# EAGLE design untitled (EAGLE 6.6.0)
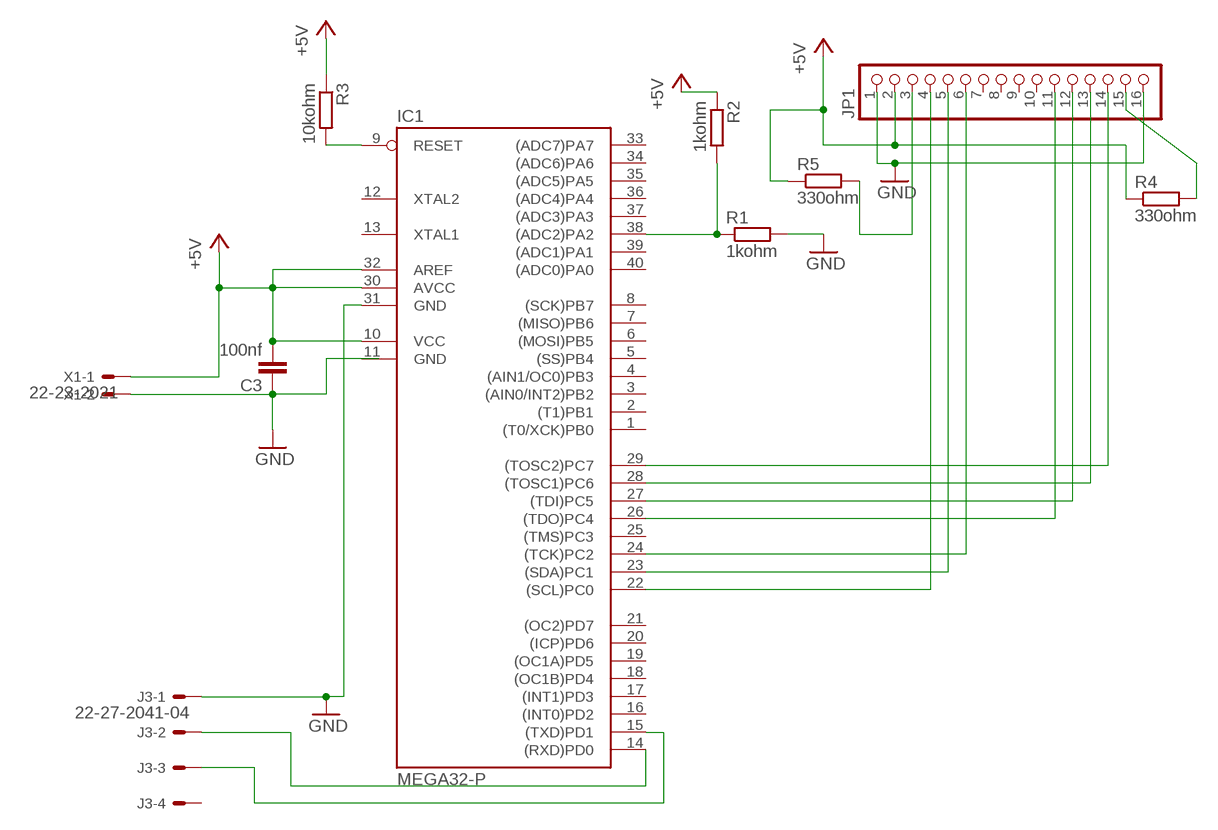
[diagram p0: schematic, sheet 1]

## Parts
C3  100nf  C-EU050-025X075  [C050-025X075]
IC1  MEGA32-P  [DIL40]
J3  22-27-2041-04  [6410-04]
JP1  PINHD-1X16  [1X16]
R1  1kohm  R-EU_0207/10  [0207/10]
R2  1kohm  R-EU_0207/10  [0207/10]
R3  10kohm  R-EU_0207/10  [0207/10]
R4  330ohm  R-EU_0207/10  [0207/10]
R5  330ohm  R-EU_0207/10  [0207/10]
X1  22-23-2021  [22-23-2021]

## Nets
+5V: C3.2 IC1.10(VCC) IC1.30(AVCC) IC1.32(AREF) JP1.2 R2.1 R3.1 R4.1 R5.1 X1.1
GND: C3.1 IC1.31(GND) J3.1 JP1.1 JP1.16 R1.2 X1.2
N$1: IC1.38((ADC2)PA2) R1.1 R2.2
N$2: IC1.22((SCL)PC0) JP1.4
N$3: IC1.23((SDA)PC1) JP1.5
N$5: IC1.29((TOSC2)PC7) JP1.14
N$6: IC1.28((TOSC1)PC6) JP1.13
N$7: IC1.27((TDI)PC5) JP1.12
N$8: IC1.26((TDO)PC4) JP1.11
N$9: IC1.9(RESET) R3.2
N$10: JP1.3 R5.2
N$12: IC1.24((TCK)PC2) JP1.6
N$14: IC1.14((RXD)PD0) J3.2
N$15: IC1.15((TXD)PD1) J3.3
N$17: JP1.15 R4.2
Unconnected: IC1.1((T0/XCK)PB0) IC1.2((T1)PB1) IC1.3((AIN0/INT2)PB2) IC1.4((AIN1/OC0)PB3) IC1.5((SS)PB4) IC1.6((MOSI)PB5) IC1.7((MISO)PB6) IC1.8((SCK)PB7) IC1.12(XTAL2) IC1.13(XTAL1) IC1.16((INT0)PD2) IC1.17((INT1)PD3) IC1.18((OC1B)PD4) IC1.19((OC1A)PD5) IC1.20((ICP)PD6) IC1.21((OC2)PD7) IC1.25((TMS)PC3) IC1.33((ADC7)PA7) IC1.34((ADC6)PA6) IC1.35((ADC5)PA5) IC1.36((ADC4)PA4) IC1.37((ADC3)PA3) IC1.39((ADC1)PA1) IC1.40((ADC0)PA0) J3.4 JP1.7 JP1.8 JP1.9 JP1.10

## Power pins joined to a net without a drawn wire
GND: IC1.11(GND)

## Library data of the parts
C3 = rcl:C-EU: CAPACITOR, European symbol
IC1 = atmel:MEGA32-P: MICROCONTROLLER 32 Kbytes FLASH 2 Kbytes SRAM 1 Kbytes EEPROM USART 8-channel 10 bit ADC Source: www.atmel.com .. doc2503.pdf; MPN: ATMEGA32-16PU; OC_FARNELL: 1661729; OC_NEWARK: 51P1794
J3 = con-molex:22-?-04: CONNECTOR wire to board 2.54 mm (.1 inch) pitch header; OC_FARNELL: unknown; OC_NEWARK: unknown
JP1 = pinhead:PINHD-1X16: PIN HEADER
R1-R5 = rcl:R-EU_: RESISTOR, European symbol
X1 = con-molex:22-23-2021: .100" (2.54mm) Center Header - 2 Pin; MF: MOLEX; MPN: 22-23-2021; OC_FARNELL: 1462926; OC_NEWARK: 25C3832

## Board
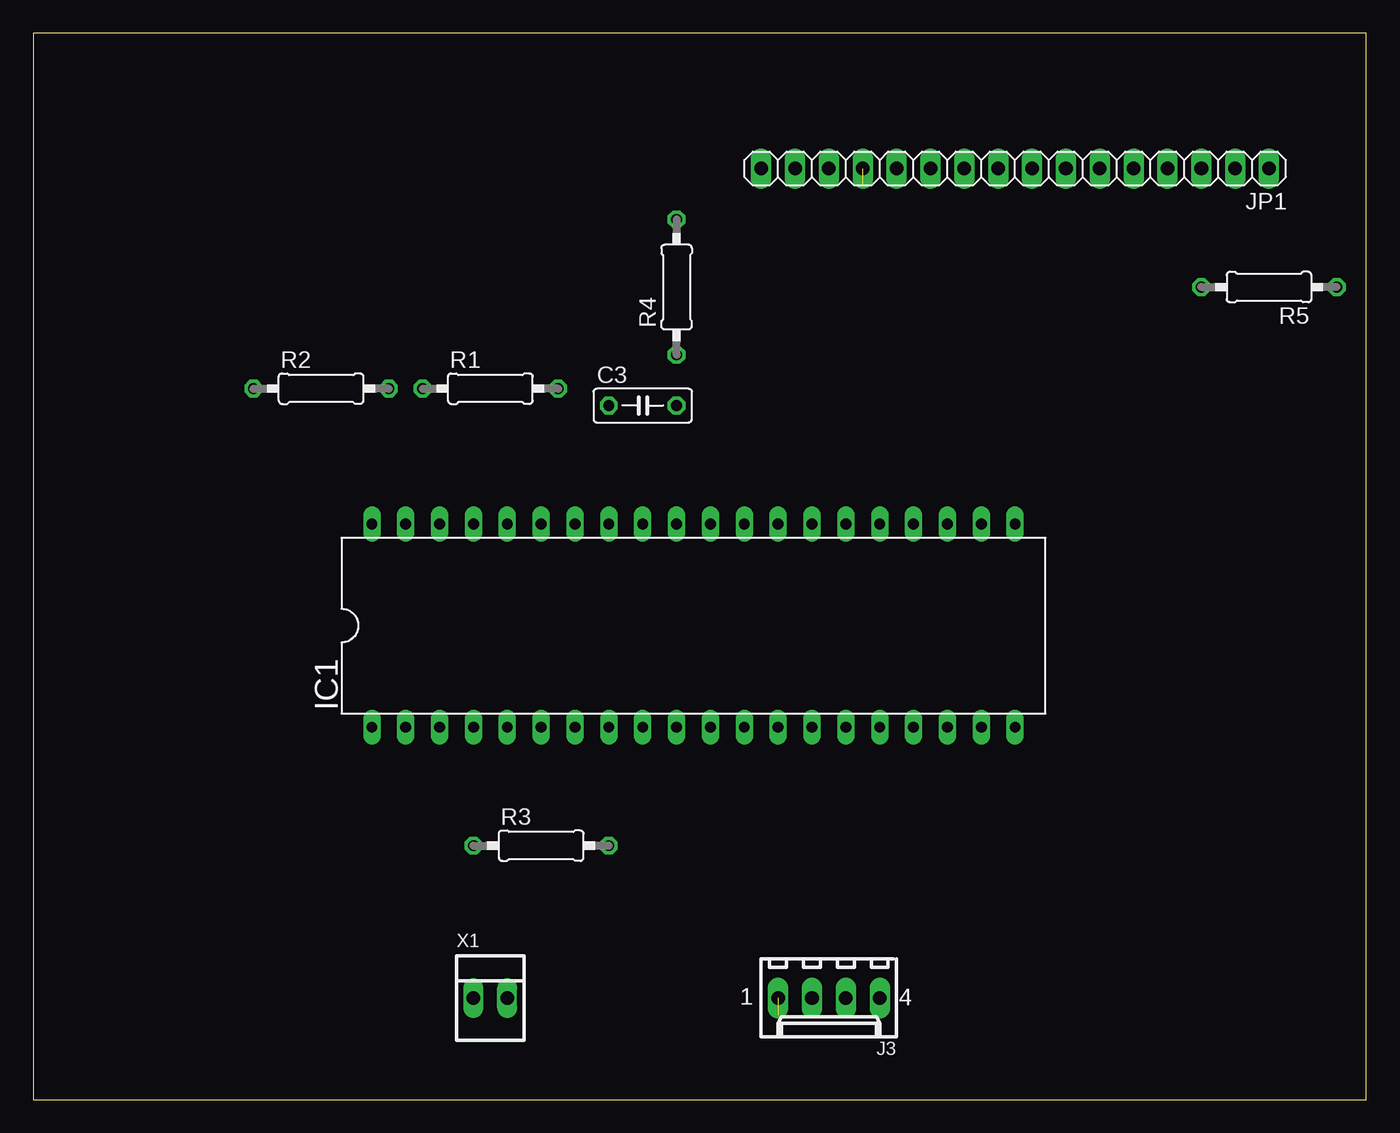
[diagram p1: board, top side]
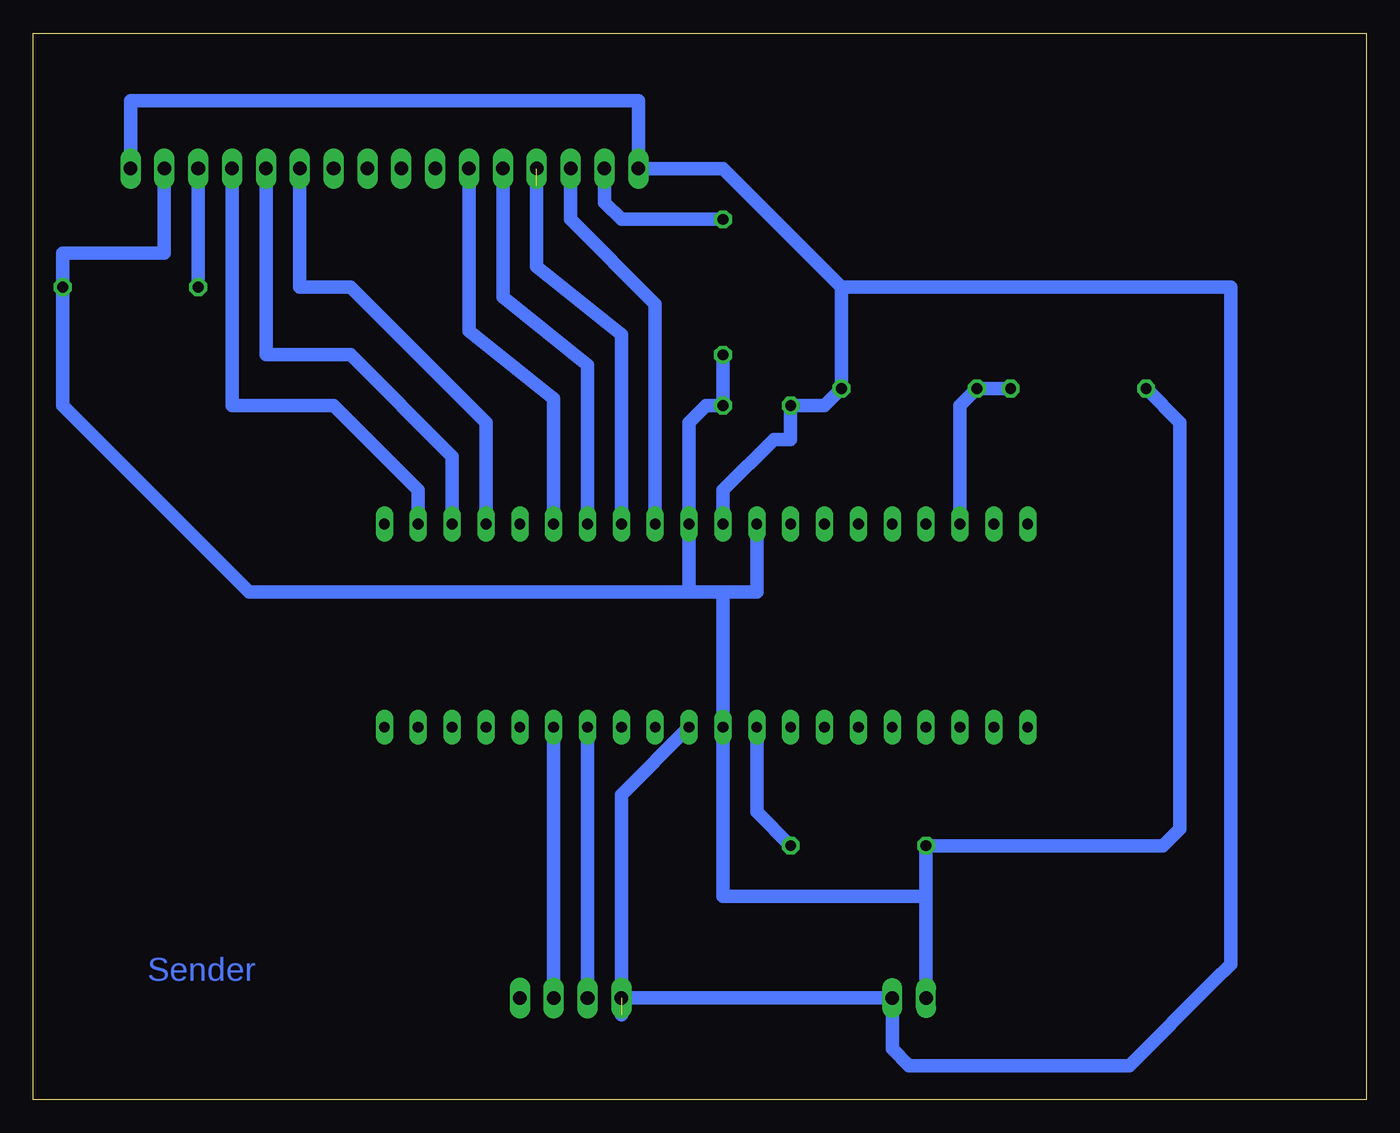
[diagram p2: board, bottom side, seen from below]

Size 100 x 80 mm. Coordinates in mm from the lower left corner, seen from the top.
Outline: 0,0 100,0 100,80 0,80 0,0
Copper layers (1*16): Top 0.035mm / dielectric 1.5mm / Bottom 0.035mm
Design rules "default": minimum track width 6mil, minimum drill 0.35mm, track to track 6mil, track to pad 6mil, pad to pad 6mil, via to via 6mil, smd to smd 6mil, copper to edge 40mil, drill to drill 6mil, minimum pad ring 10mil, minimum via ring 8mil, stop-mask expansion 4mil, vias tented up to drill 0mil, thermal gap 10mil

### Footprints (pad centres in the part's own frame; a part is rotated, then mirrored left to right if it is on the bottom)
C050-025X075 = drill 0.813 octagon: 1 -2.54,0; 2 2.54,0
DIL40 = drill 0.813 long: 1 -24.13,-7.62; 2 -21.59,-7.62; 3 -19.05,-7.62; 4 -16.51,-7.62; 5 -13.97,-7.62; 6 -11.43,-7.62; 7 -8.89,-7.62; 8 -6.35,-7.62; 9 -3.81,-7.62; 10 -1.27,-7.62; 11 1.27,-7.62; 12 3.81,-7.62; 13 6.35,-7.62; 14 8.89,-7.62; 15 11.43,-7.62; 16 13.97,-7.62; 17 16.51,-7.62; 18 19.05,-7.62; 19 21.59,-7.62; 20 24.13,-7.62; 21 24.13,7.62; 22 21.59,7.62; 23 19.05,7.62; 24 16.51,7.62; 25 13.97,7.62; 26 11.43,7.62; 27 8.89,7.62; 28 6.35,7.62; 29 3.81,7.62; 30 1.27,7.62; 31 -1.27,7.62; 32 -3.81,7.62; 33 -6.35,7.62; 34 -8.89,7.62; 35 -11.43,7.62; 36 -13.97,7.62; 37 -16.51,7.62; 38 -19.05,7.62; 39 -21.59,7.62; 40 -24.13,7.62
6410-04 = drill 1.016 long: 1 3.81,0; 2 1.27,0; 3 -1.27,0; 4 -3.81,0
1X16 = drill 1.016 long: 1 -19.05,0; 2 -16.51,0; 3 -13.97,0; 4 -11.43,0; 5 -8.89,0; 6 -6.35,0; 7 -3.81,0; 8 -1.27,0; 9 1.27,0; 10 3.81,0; 11 6.35,0; 12 8.89,0; 13 11.43,0; 14 13.97,0; 15 16.51,0; 16 19.05,0
0207/10 = drill 0.813 octagon: 1 -5.08,0; 2 5.08,0
22-23-2021 = drill 1 long: 1 -1.27,0; 2 1.27,0

### Placement (x,y rotation side)
C3  45.72,52.07 0 top
IC1  49.53,35.56 0 top
J3  59.69,7.62 180 top
JP1  73.66,69.85 180 top
R1  34.29,53.34 0 top
R2  21.59,53.34 0 top
R3  38.1,19.05 0 top
R4  48.26,60.96 90 top
R5  92.71,60.96 180 top
X1  34.29,7.62 0 top

### Tracks (layer width: path | path; a pad name or v marks a point on that pad's centre or on a via)
+5V
  Bottom 1.016: R2.1 13.97,50.8 13.97,20.32 15.24,19.05 R3.1 33.02,15.24 | R4.1 C3.2 49.53,52.07 50.8,50.8 IC1.30 50.8,38.1 | 48.26,38.1 IC1.10 48.26,15.24 33.02,15.24 | X1.1 33.02,15.24 | JP1.2 90.17,63.5 97.79,63.5 R5.1 97.79,52.07 83.82,38.1 50.8,38.1 | IC1.32 45.72,38.1 48.26,38.1 | 50.8,38.1 48.26,38.1
GND  (1 unrouted)
  Bottom 1.016: 39.37,60.96 R1.2 40.64,52.07 C3.1 43.18,49.53 44.45,49.53 48.26,45.72 IC1.31 | 39.37,60.96 48.26,69.85 JP1.16 54.61,74.93 92.71,74.93 JP1.1 | J3.1 X1.2 35.56,3.81 34.29,2.54 17.78,2.54 11.43,8.89 10.16,10.16 10.16,60.96 39.37,60.96 | IC1.11 55.88,22.86 55.88,6.35
N$1
  Bottom 1.016: R2.2 R1.1 30.48,52.07 IC1.38
N$2
  Bottom 1.016: IC1.22 71.12,45.72 77.47,52.07 85.09,52.07 JP1.4
N$3
  Bottom 1.016: IC1.23 68.58,48.26 76.2,55.88 82.55,55.88 JP1.5
N$5
  Bottom 1.016: IC1.29 53.34,59.69 59.69,66.04 JP1.14
N$6  (1 unrouted)
  Bottom 1.016: IC1.28 55.88,57.4 62.23,62.48 62.23,68.58
N$7
  Bottom 1.016: IC1.27 58.42,55.12 64.77,60.2 JP1.12
N$8
  Bottom 1.016: IC1.26 60.96,52.58 67.31,57.66 JP1.11
N$9
  Bottom 1.016: R3.2 45.72,21.59 IC1.9
N$10
  Bottom 1.016: JP1.3 R5.2
N$12
  Bottom 1.016: IC1.24 66.04,50.8 76.2,60.96 80.01,60.96 JP1.6
N$14
  Bottom 1.016: J3.2 IC1.14
N$15
  Bottom 1.016: J3.3 IC1.15
N$17
  Bottom 1.016: JP1.15 57.15,67.31 55.88,66.04 R4.2

### Text on the board
Bottom: Sender